# Altium schematic sheet MSW_V1.SchDoc
size B; Organization: ORGANIZATION; Address1: ADDRESS 1; Address2: ADDRESS 2; Address3: ADDRESS 3; Address4: ADDRESS 4; Revision: -; SheetNumber: 1; SheetTotal: 1; ENG_APP_DATE: --/--/--; DSN_APP_DATE: --/--/--; CHK_APP_DATE: --/--/--
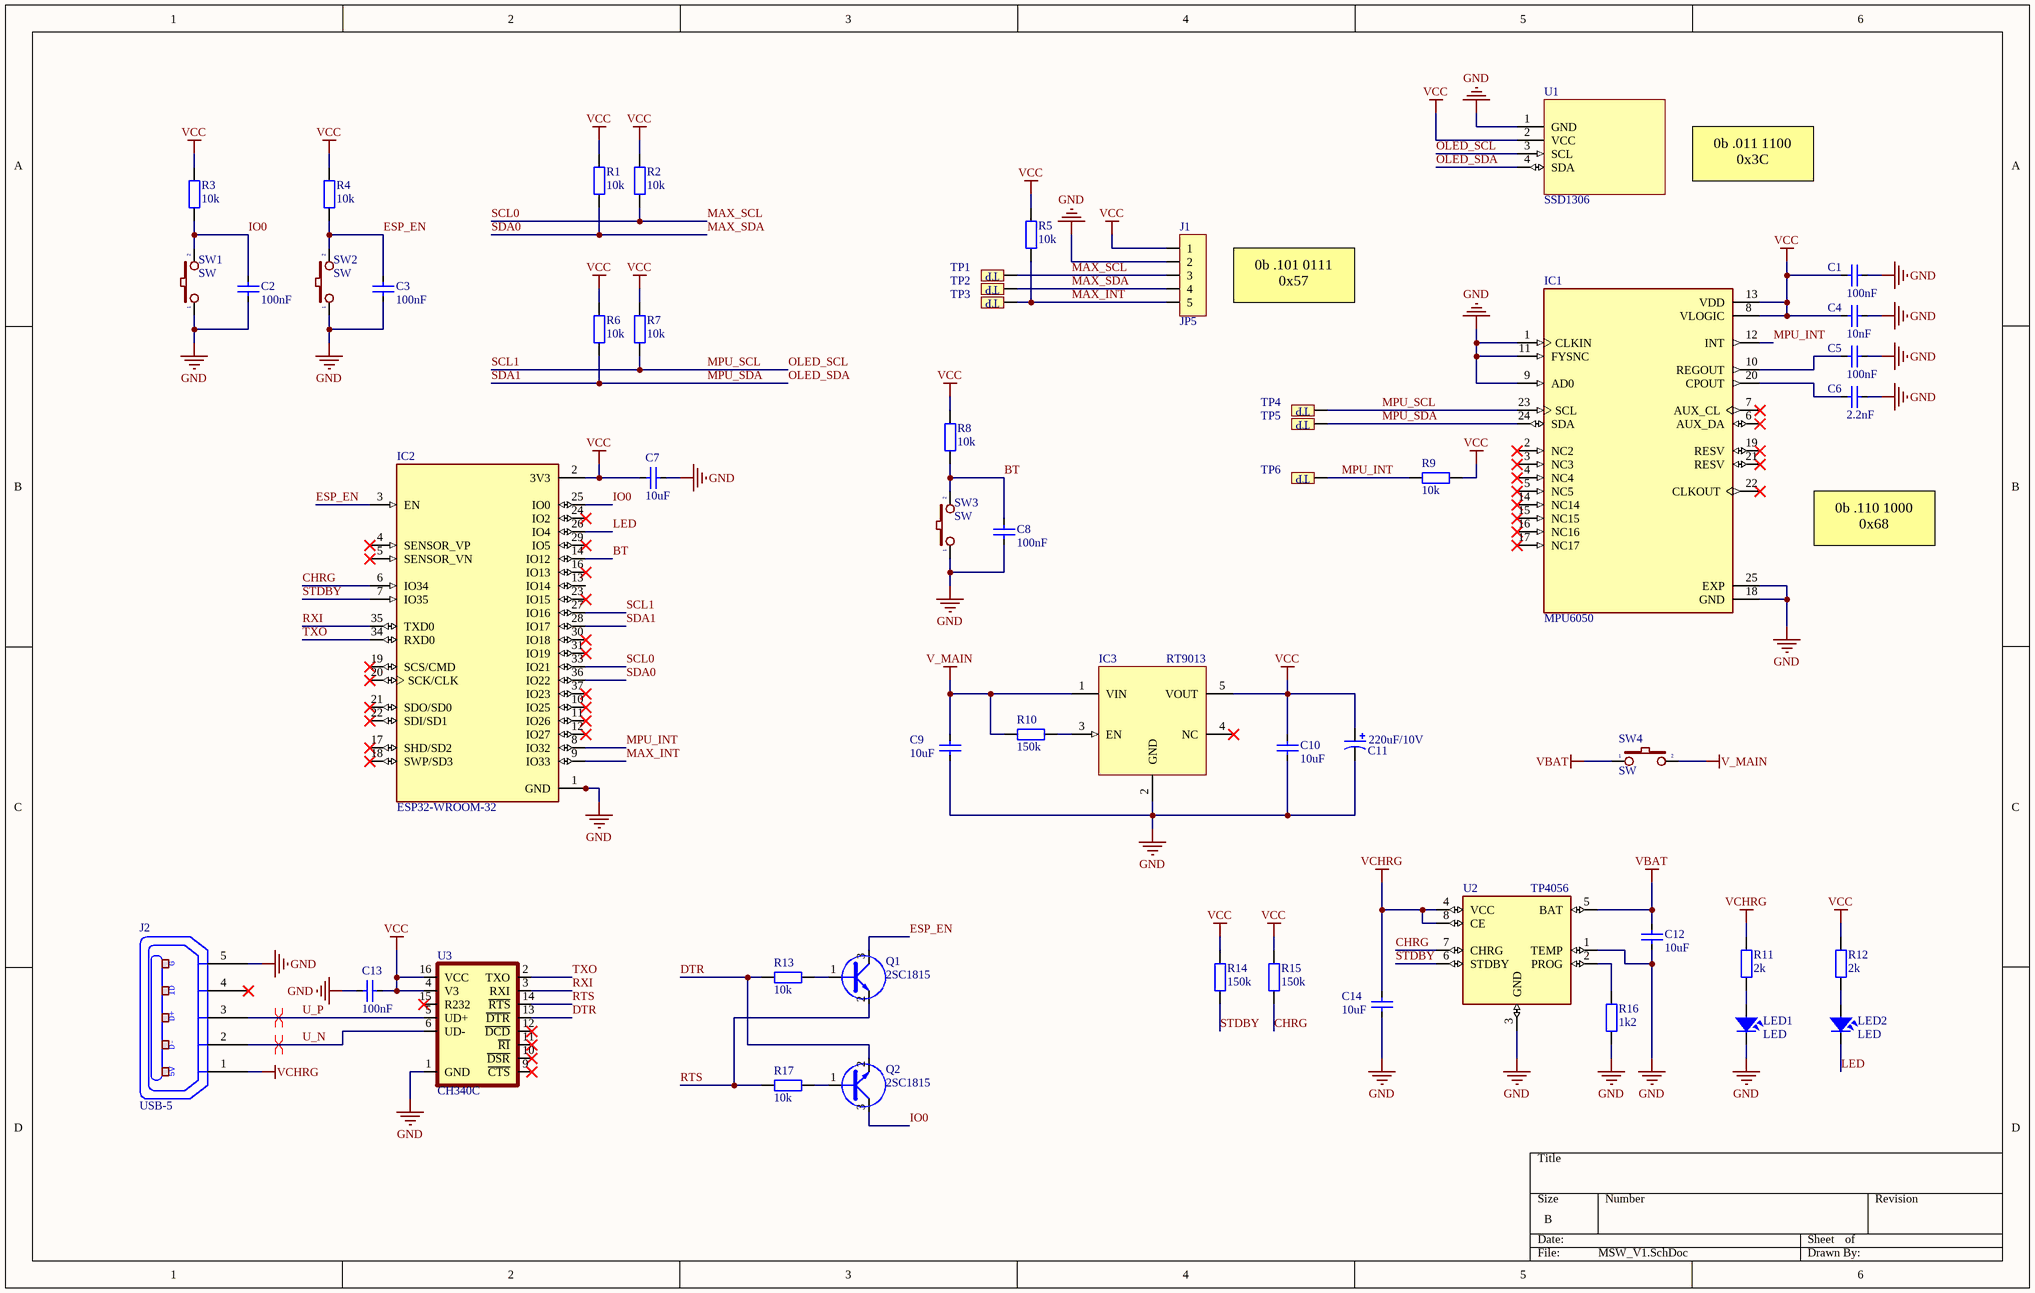
[diagram p0: MSW_V1.SchDoc]

## Parts
C1  100nF  [CAP_0603]
C2  100nF  [CAP_0603]
C3  100nF  [CAP_0603]
C4  10nF  [CAP_0603]
C5  100nF  [CAP_0603]
C6  2.2nF  [CAP_0603]
C7  10uF  [CAP_0603]
C8  100nF  [CAP_0603]
C9  10uF  [CAP_0603]
C10  10uF  [CAP_0603]
C11  220uF/10V  [CAP_7343]
C12  10uF  [CAP_0603]
C13  100nF  [CAP_0603]
C14  10uF  [CAP_0603]
IC1  MPU6050  [QFN24]
IC2  ESP32-WROOM-32  [MODULE_ESP32-WROOM-32]
IC3  RT9013  [SOT23-5]
J1  JP5  [Header5 - TH - 1.25MM]
J2  USB-5  [USB-M1]
LED1  LED  [LED-0805-Red]
LED2  LED  [LED-1206-Blue]
Q1  2SC1815  [SOT23D]
Q2  2SC1815  [SOT23D]
R1  10k  [RES-SMD-0603]
R2  10k  [RES-SMD-0603]
R3  10k  [RES-SMD-0603]
R4  10k  [RES-SMD-0603]
R5  10k  [RES-SMD-0603]
R6  10k  [RES-SMD-0603]
R7  10k  [RES-SMD-0603]
R8  10k  [RES-SMD-0603]
R9  10k  [RES-SMD-0603]
R10  150k  [RES-SMD-0603]
R11  2k  [RES-SMD-0603]
R12  2k  [RES-SMD-0603]
R13  10k  [RES-SMD-0603]
R14  150k  [RES-SMD-0603]
R15  150k  [RES-SMD-0603]
R16  1k2  [RES-SMD-0603]
R17  10k  [RES-SMD-0603]
SW1  SW  [SW 3x2x4]
SW2  SW  [SW 3x2x4]
SW3  SW  [SW 3x2x4]
SW4  SW  [SW102_SIDE]
TP1  TP  [TP_SMD]  (value not drawn)
TP2  TP  [TP_SMD]  (value not drawn)
TP3  TP  [TP_SMD]  (value not drawn)
TP4  TP  [TP_SMD]  (value not drawn)
TP5  TP  [TP_SMD]  (value not drawn)
TP6  TP  [TP_SMD]  (value not drawn)
U1  SSD1306  [OLED 1.3 SSD1306 PRETTY NON POLE]
U2  TP4056  [TP4056]
U3  CH340C  [SOP-16]

## Nets
GND: C1.1 C2.2 C3.2 C4.1 C5.1 C6.1 C7.2 C8.2 C9.1 C10.1 C11.2 C12.1 C13.1 C14.1 IC1.1(CLKIN) IC1.9(AD0) IC1.11(FYSNC) IC1.18(GND) IC1.25(EXP) IC2.1(GND) IC2.15(GND) IC2.38(GND) IC2.39_1(GND) IC2.39_2(GND) IC2.39_3(GND) IC2.39_4(GND) IC2.39_5(GND) IC2.39_6(GND) IC2.39_7(GND) IC2.39_8(GND) IC2.39_9(GND) IC2.39_10(GND) IC2.39_11(GND) IC2.39_12(GND) IC2.39_13(GND) IC2.39_14(GND) IC2.39_15(GND) IC2.39_16(GND) IC2.39_17(GND) IC2.39_18(GND) IC2.39_19(GND) IC2.39_20(GND) IC2.39_21(GND) IC3.2(GND) J1.2 J2.5(P5) LED1.2 R16.1 SW1.1 SW2.1 SW3.1 U1.1(GND) U2.1(TEMP) U2.3(GND) U3.1(GND)
V_MAIN: C9.2 IC3.1(VIN) R10.1 SW4.2
VBAT: C12.2 SW4.1 U2.5(BAT)
VCC: C1.2 C4.2 C7.1 C10.2 C11.1 C13.2 IC1.8(VLOGIC) IC1.13(VDD) IC2.2(3V3) IC3.5(VOUT) J1.1 R1.2 R2.2 R3.2 R4.2 R5.1 R6.2 R7.2 R8.2 R9.1 R12.2 R14.1 R15.1 U1.2(VCC) U3.4(V3) U3.16(VCC)
VCHRG: C14.2 J2.1(P1) R11.2 U2.4(VCC) U2.8(CE)
BT: C8.1 IC2.14(IO12) R8.1 SW3.2
CHRG: IC2.6(IO34) R15.2 U2.7(CHRG)
DTR: Q2.2(E) R13.2 U3.13(~{DTR})
ESP_EN: C3.1 IC2.3(EN) Q1.3(C) R4.1 SW2.2
IO0: C2.1 IC2.25(IO0) Q2.3(C) R3.1 SW1.2
LED: IC2.26(IO4) LED2.2
MAX_INT: IC2.9(IO33) J1.5 R5.2 TP3.1
MAX_SCL: IC2.33(IO21) J1.3 R2.1 TP1.1  [also labelled SCL0]
MAX_SDA: IC2.36(IO22) J1.4 R1.1 TP2.1  [also labelled SDA0]
MPU_INT: IC1.12(INT) IC2.8(IO32) R9.2 TP6.1
MPU_SCL: IC1.23(SCL) IC2.27(IO16) R7.1 TP4.1 U1.3(SCL)  [also labelled OLED_SCL, SCL1]
MPU_SDA: IC1.24(SDA) IC2.28(IO17) R6.1 TP5.1 U1.4(SDA)  [also labelled OLED_SDA, SDA1]
RTS: Q1.2(E) R17.2 U3.14(~{RTS})
RXI: IC2.35(TXD0) U3.3(RXI)
STDBY: IC2.7(IO35) R14.2 U2.6(STDBY)
TXO: IC2.34(RXD0) U3.2(TXO)
U_N: J2.2(P2) U3.6(UD-)
U_P: J2.3(P3) U3.5(UD+)
NetC5_2: C5.2 IC1.10(REGOUT)
NetC6_2: C6.2 IC1.20(CPOUT)
NetIC3_3: IC3.3(EN) R10.2
NetLED1_1: LED1.1 R11.1
NetLED2_1: LED2.1 R12.1
NetQ1_1: Q1.1(B) R13.1
NetQ2_1: Q2.1(B) R17.1
NetR16_2: R16.2 U2.2(PROG)

Not connected (* = marked no-connect by the designer): IC1 2(NC2)* 3(NC3)* 4(NC4)* 5(NC5)* 6(AUX_DA)* 7(AUX_CL)* 14(NC14)* 15(NC15)* 16(NC16)* 17(NC17)* 19(RESV)* 21(RESV)* 22(CLKOUT)*; IC2 4(SENSOR_VP)* 5(SENSOR_VN)* 10(IO25)* 11(IO26)* 12(IO27)* 13(IO14) 16(IO13)* 17(SHD/SD2)* 18(SWP/SD3)* 19(SCS/CMD)* 20(SCK/CLK)* 21(SDO/SD0)* 22(SDI/SD1)* 23(IO15)* 24(IO2)* 29(IO5)* 30(IO18)* 31(IO19)* 37(IO23)*; IC3 4(NC)*; J2 4(P4)*; U3 9(~{CTS})* 10(~{DSR})* 11(~{RI})* 12(~{DCD})* 15(R232)*

## Layout directives
differential pair: U_N, U_P

## Notes on the sheet
- 0b .011 1100
  0x3C
- 0b .101 0111
  0x57
- 0b .110 1000
  0x68
- DWG. NO.
- REV.
- SHT.
- THIS DOCUMENT AND THE DATA DISCLOSED HEREIN OR HEREWITH IS THE PROPERTY OF ALTIUM LIMITED AND MAY BE FREELY DISTRIBUTED IN WHOLE. NO RIGHTS ARE RESERVED OR EXPRESS OR IMPLIED WARANTEE GIVEN.
- REVISION
- DESCRIPTION
- DATE
- APPROVED
- ENG:
- APPROVALS
- PROJECT
- DSN:
- CHK:
- REFERENCE DOCUMENTS
- PROJECT REVISION:
- TITLE
- DOCUMENT REVISION:
- DESIGN ITEM:
- BOM:
- FAB DWG:
- PCB DWG:
- ASSY DWG:
- SCALE:
- SIZE
- B
- CAGE CODE
- FILE NAME
- DWG NO.
- SHEET
- OF
- REV
- (in symbol USB-5) G; ID; D+; D-; 5V

## Library data of the parts
C1-C10 C12-C14 = CapSMD: Capacitor; Value: 33p; Published: 8-Jun-2000; LatestRevisionDate: 17-Jul-2002; LatestRevisionNote: Re-released for DXP Platform.; PackageReference: RAD-0.3; Publisher: Altium Limited
C11 = CAP_TAN_SMD: Polazied Tantalum Capacitor
IC1 = MPU6050_Chip: 3-axis gyroscope, 3-axis accelerometer
IC2 = ESP32-WROOM-32: Bluetooth, WiFi Transceiver Module 2.4GHz ~ 2.5GHz Surface Mount; MF: Espressif Systems; Package: Module Espressif Systems; Digi-Key_Part_Number: 1904-1010-1-ND; Digi-Key_Purchase_URL: https://www.digikey.com/product-detail/en/espressif-systems/ESP32-WROOM-32/1904-1010-1-ND/8544305?utm_source=snapeda&utm_medium=aggregator&utm_campaign=symbol; Value: *; MP: ESP32-WROOM-32; SnapEDA_Link: https://www.snapeda.com/parts/ESP32-WROOM-32/Espressif%20Systems/view-part/2753322/?ref=snap
IC3 = RT9013: RT9013-33GB IC REG LINEAR 3.3V 500mA SOT23-5
J1 = JP5x1: WR-PHD 2.54 mm Angled Socket Header; Manufacturer: W¨¹rth Elektronik eiSos GmbH; partNo: 613005143121; ComponentLink1 Description: Manufacturer; ComponentLink2 Description: Datasheet; NoPins: 05; Created Date: 29 March 2013; ComponentLink1URL: http://www.we-online.com; ComponentLink2URL: http://katalog.we-online.de/em/datasheet/6130xx143121.pdf; Created by: Karrer Zheng
J2 = USB-5: Manufacturer: FCI; Manufacturer Part Number: 10118193-0001LF; Connector Type: USB - micro B; Number of Contacts: 5; Gender: Receptacle; Specifications: USB 2.0; .Creator: MM; .Checked PCB: RF; Supplier 1: Digi-Key; RoHS: RoHS Compliant; Category: Connectors, Interconnects; Stock 1: 28642; Pricing 1: 1=0.46, 10=0.433, 25=0.3712, 50=0.3156, 100=0.3032, 250=0.27224, 500=0.25988 (USD); Packaging: Cut Tape (CT); Mounting Type: Surface Mount, Right Angle, Horizontal; Features: Shielded, Solder Retention; Ingress Protection: -; ComponentLink1URL: http://portal.fciconnect.com/Comergent//fci/drawing/10118193.pdf; ComponentLink1Description: http://portal.fciconnect.com/Comergent//fci/drawing/10118193.pdf; Supplier Part Number 1: 609-4616-1-ND; .Checked SCH: MM
LED1 LED2 = LED: LED Single colour Green and Red; Value: LED 3 ly Single Colour
Q1 Q2 = C1815: NPN 600mW, ECB; Value: C1815
R1-R17 = Resistor - SMD: Resistor SMD; Manufacturer: Generic Components; Class: Passive; Published: 08/06/2000; Publisher: Altium Hobart Technology Centre
SW1-SW4 = SW2: Switch button 2 pin; Value: SW chip 2 pin
TP1-TP6 = TP: CONNECT 1
U1 = OLED 1.3 SSD1306: OLED Display 1.3" SSD1306
U2 = TP4056: Complete single cell Li-Ion battery with a constant current / constant voltage linear charger
U3 = CH340C: USB to serial chip CH340; MF: WCH; Package: Package; Check_prices: https://www.snapeda.com/parts/CH340C/WCH/view-part/5428851/?ref=eda; Value: *; Price: None; MP: CH340C; Availability: Unavailable; SnapEDA_Link: https://www.snapeda.com/parts/CH340C/WCH/view-part/5428851/?ref=snap